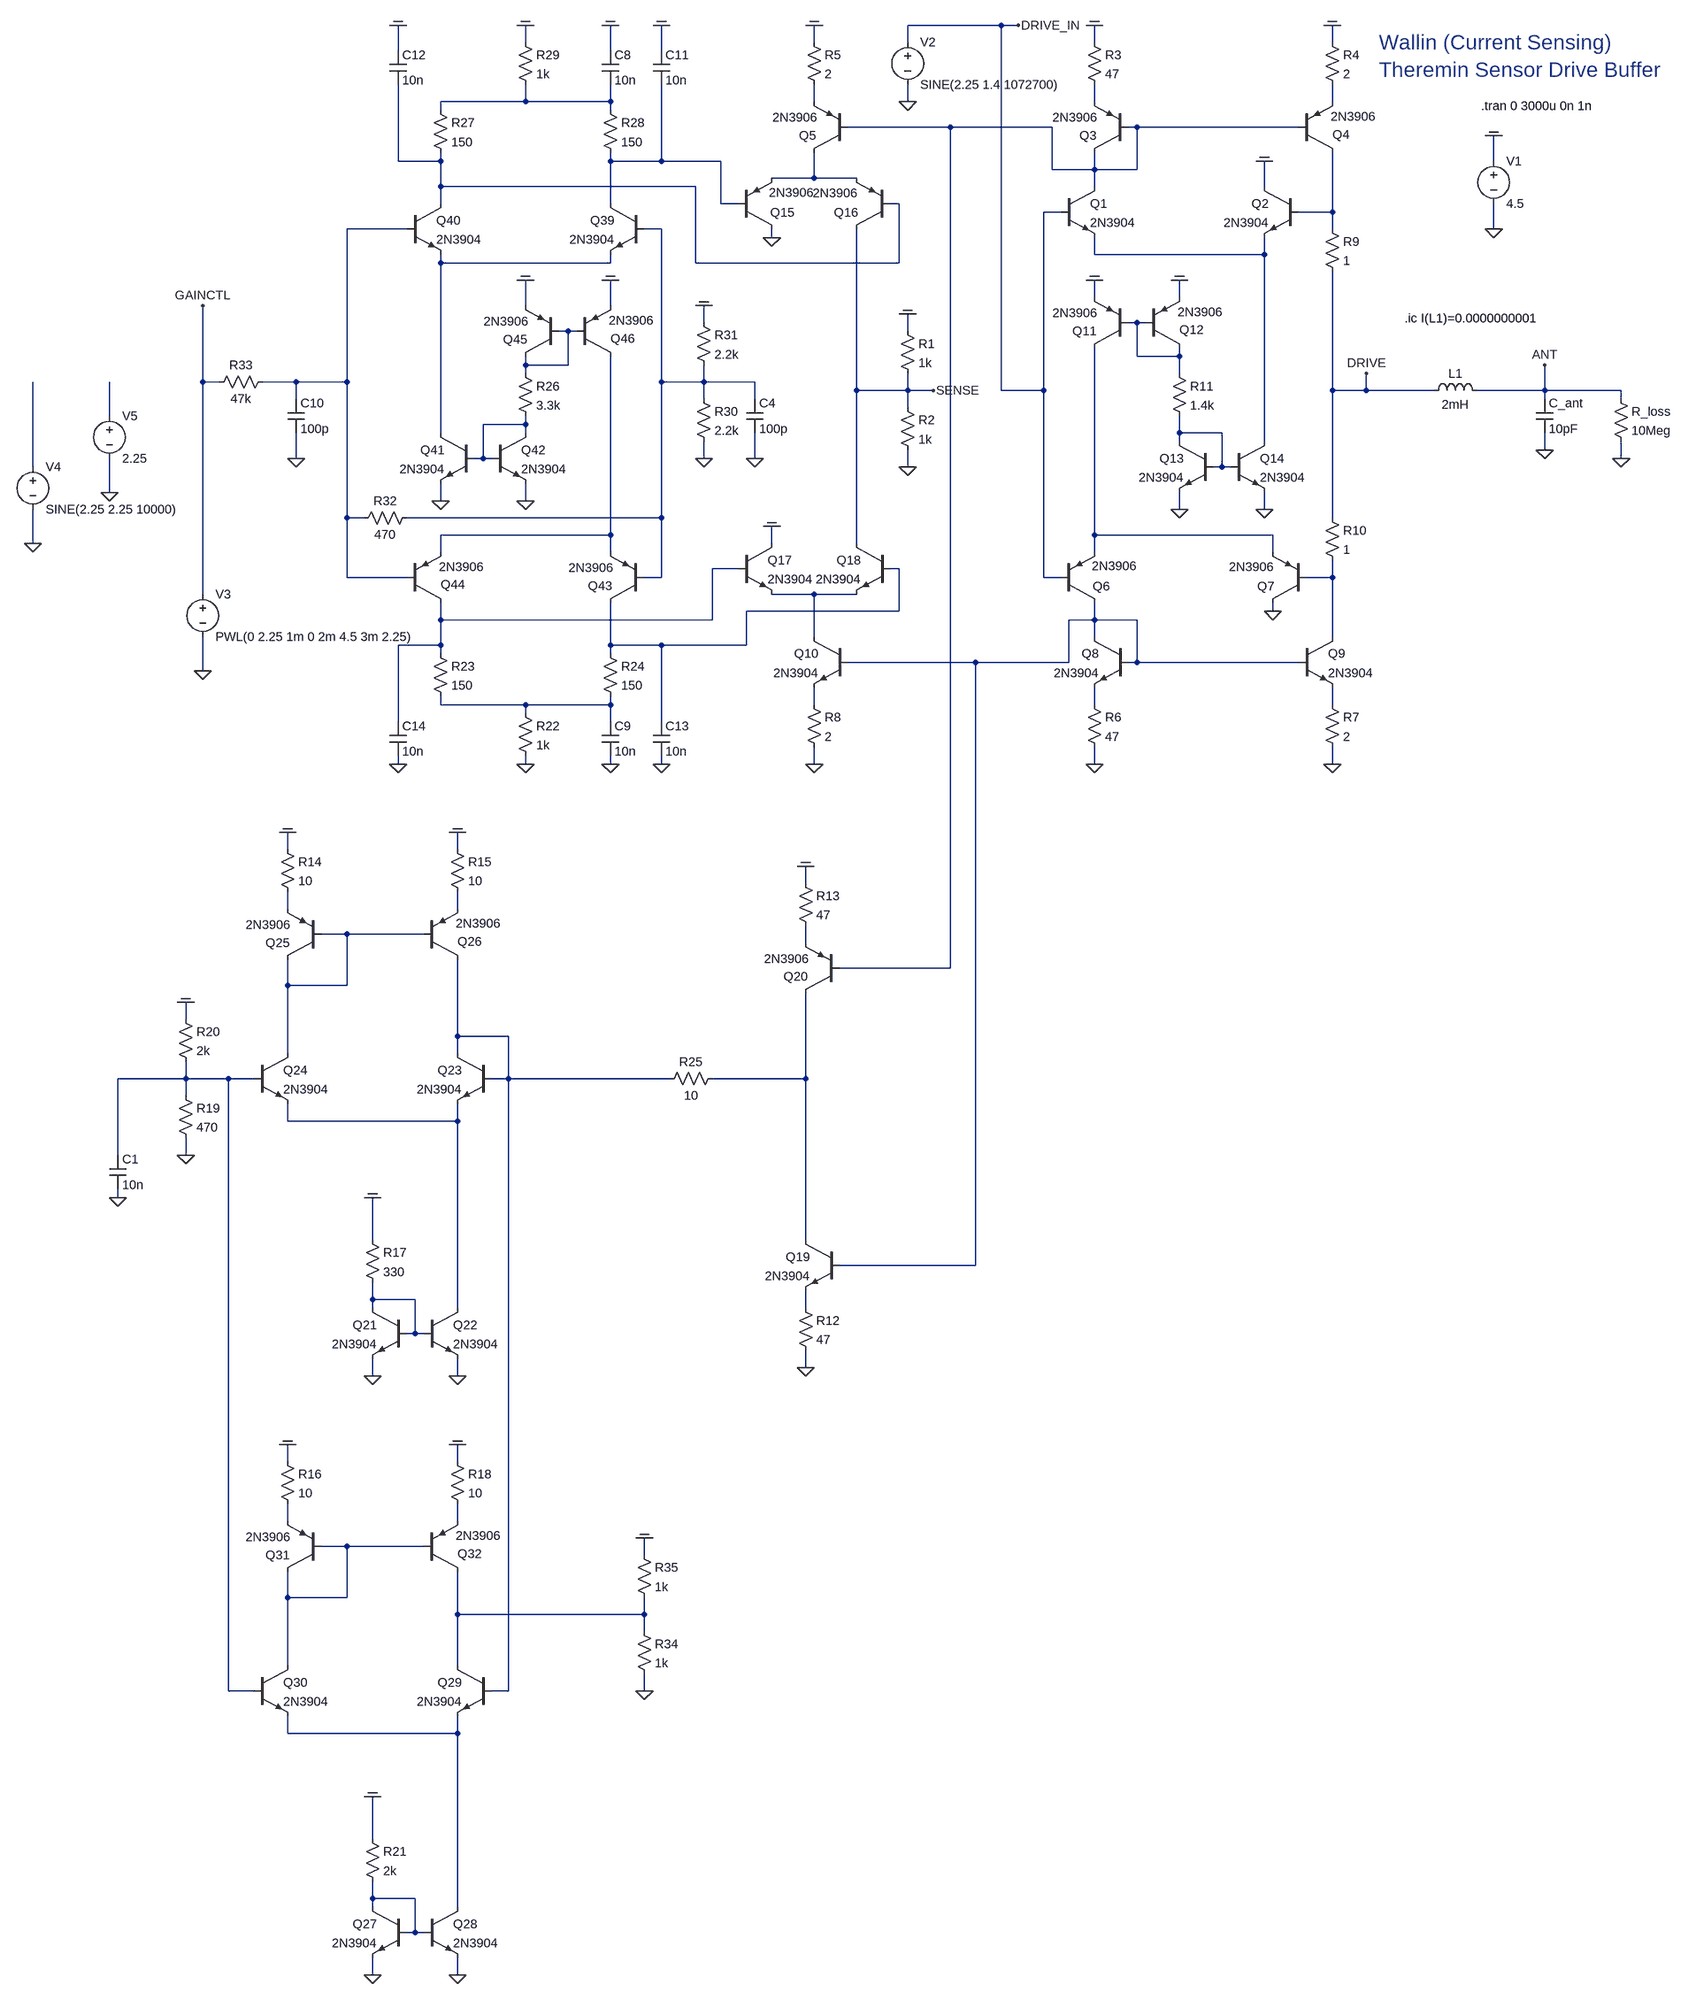
[diagram p0: schematic current_sensing_drive_buffer_v05.asc]
current_sensing_drive_buffer_v05.asc, the LTspice schematic file:
Version 4
SHEET 1 4504 7040
WIRE 1088 2256 912 2256
WIRE 1120 2256 1088 2256
WIRE 192 2288 192 2256
WIRE 736 2288 736 2256
WIRE 912 2288 912 2256
WIRE 1264 2288 1264 2256
WIRE 1712 2288 1712 2256
WIRE -48 2304 -48 2256
WIRE 352 2304 352 2256
WIRE 448 2304 448 2256
WIRE 192 2400 192 2368
WIRE 192 2400 32 2400
WIRE 352 2400 352 2368
WIRE 352 2400 192 2400
WIRE 736 2400 736 2368
WIRE 912 2400 912 2368
WIRE 1264 2400 1264 2368
WIRE 1712 2400 1712 2368
WIRE 32 2416 32 2400
WIRE 352 2416 352 2400
WIRE 992 2448 800 2448
WIRE 1184 2448 992 2448
WIRE 1344 2448 1328 2448
WIRE 1648 2448 1344 2448
WIRE -48 2512 -48 2368
WIRE 32 2512 32 2496
WIRE 32 2512 -48 2512
WIRE 352 2512 352 2496
WIRE 448 2512 448 2368
WIRE 448 2512 352 2512
WIRE 560 2512 448 2512
WIRE 2016 2512 2016 2464
WIRE 1184 2528 1184 2448
WIRE 1264 2528 1264 2496
WIRE 1264 2528 1184 2528
WIRE 1344 2528 1344 2448
WIRE 1344 2528 1264 2528
WIRE 736 2544 736 2496
WIRE 736 2544 656 2544
WIRE 816 2544 736 2544
WIRE 32 2560 32 2512
WIRE 512 2560 32 2560
WIRE 1264 2560 1264 2528
WIRE 1584 2560 1584 2512
WIRE 32 2592 32 2560
WIRE 352 2592 352 2512
WIRE 560 2592 560 2512
WIRE 592 2592 560 2592
WIRE 896 2592 880 2592
WIRE 1200 2608 1168 2608
WIRE 1712 2608 1712 2496
WIRE 1712 2608 1648 2608
WIRE -32 2640 -144 2640
WIRE 448 2640 416 2640
WIRE 1712 2640 1712 2608
WIRE 2016 2640 2016 2592
WIRE 656 2656 656 2640
WIRE 1264 2688 1264 2656
WIRE 1584 2688 1584 2656
WIRE 1584 2688 1264 2688
WIRE 32 2704 32 2688
WIRE 352 2704 352 2688
WIRE 352 2704 32 2704
WIRE 512 2704 512 2560
WIRE 896 2704 896 2592
WIRE 896 2704 512 2704
WIRE 1264 2768 1264 2736
WIRE 1424 2768 1424 2736
WIRE 192 2784 192 2736
WIRE 352 2784 352 2736
WIRE 528 2816 528 2784
WIRE 1344 2816 1328 2816
WIRE 1360 2816 1344 2816
WIRE 272 2832 256 2832
WIRE 288 2832 272 2832
WIRE 912 2832 912 2800
WIRE 1344 2880 1344 2816
WIRE 1424 2880 1424 2864
WIRE 1424 2880 1344 2880
WIRE 192 2896 192 2880
WIRE 272 2896 272 2832
WIRE 272 2896 192 2896
WIRE 192 2912 192 2896
WIRE 1424 2912 1424 2880
WIRE -416 2928 -416 2784
WIRE -384 2928 -416 2928
WIRE -240 2928 -304 2928
WIRE -144 2928 -144 2640
WIRE -144 2928 -240 2928
WIRE 448 2928 448 2640
WIRE 528 2928 528 2896
WIRE 528 2928 448 2928
WIRE 624 2928 528 2928
WIRE 816 2944 816 2640
WIRE 912 2944 912 2912
WIRE 912 2944 816 2944
WIRE 960 2944 912 2944
WIRE 1088 2944 1088 2256
WIRE 1168 2944 1168 2608
WIRE 1168 2944 1088 2944
WIRE 1712 2944 1712 2720
WIRE 1776 2944 1776 2912
WIRE 1776 2944 1712 2944
WIRE 1904 2944 1776 2944
WIRE 2112 2944 2112 2896
WIRE 2112 2944 1984 2944
WIRE 2256 2944 2112 2944
WIRE -240 2960 -240 2928
WIRE 528 2960 528 2928
WIRE 624 2960 624 2928
WIRE 2112 2960 2112 2944
WIRE 2256 2960 2256 2944
WIRE 912 2976 912 2944
WIRE -592 2992 -592 2928
WIRE 192 3008 192 2992
WIRE 192 3008 112 3008
WIRE 32 3024 32 2704
WIRE 192 3024 192 3008
WIRE 1424 3024 1424 2992
WIRE 1504 3024 1424 3024
WIRE 1424 3040 1424 3024
WIRE 1584 3040 1584 2688
WIRE 2112 3056 2112 3024
WIRE -240 3072 -240 3024
WIRE 112 3072 112 3008
WIRE 112 3072 96 3072
WIRE 128 3072 112 3072
WIRE 528 3072 528 3040
WIRE 624 3072 624 3024
WIRE 2256 3072 2256 3040
WIRE -736 3088 -736 2928
WIRE 912 3088 912 3056
WIRE 1504 3088 1504 3024
WIRE 1504 3088 1488 3088
WIRE 1520 3088 1504 3088
WIRE -592 3136 -592 3072
WIRE 32 3152 32 3120
WIRE 192 3152 192 3120
WIRE 1424 3168 1424 3136
WIRE 1584 3168 1584 3136
WIRE -144 3184 -144 2928
WIRE -112 3184 -144 3184
WIRE 448 3184 448 2928
WIRE 448 3184 -32 3184
WIRE 1712 3184 1712 2944
WIRE 352 3216 352 2880
WIRE 352 3216 32 3216
WIRE 1264 3216 1264 2864
WIRE 1600 3216 1264 3216
WIRE -736 3232 -736 3168
WIRE 656 3232 656 3200
WIRE 816 3232 816 2944
WIRE 32 3248 32 3216
WIRE 352 3248 352 3216
WIRE 1264 3248 1264 3216
WIRE 1600 3248 1600 3216
WIRE 592 3280 544 3280
WIRE 896 3280 880 3280
WIRE -144 3296 -144 3184
WIRE -32 3296 -144 3296
WIRE 448 3296 448 3184
WIRE 448 3296 416 3296
WIRE 1168 3296 1168 2944
WIRE 1200 3296 1168 3296
WIRE 1712 3296 1712 3264
WIRE 1712 3296 1664 3296
WIRE -416 3328 -416 2928
WIRE 736 3328 656 3328
WIRE 816 3328 736 3328
WIRE 896 3360 896 3280
WIRE 896 3360 608 3360
WIRE 1600 3360 1600 3344
WIRE 32 3376 32 3344
WIRE 544 3376 544 3280
WIRE 544 3376 32 3376
WIRE 1264 3376 1264 3344
WIRE 1264 3376 1216 3376
WIRE 1344 3376 1264 3376
WIRE 736 3408 736 3328
WIRE 1264 3408 1264 3376
WIRE 1712 3408 1712 3296
WIRE 32 3424 32 3376
WIRE 32 3424 -48 3424
WIRE 352 3424 352 3344
WIRE 448 3424 352 3424
WIRE 608 3424 608 3360
WIRE 608 3424 448 3424
WIRE 32 3440 32 3424
WIRE 352 3440 352 3424
WIRE 1040 3456 800 3456
WIRE 1216 3456 1216 3376
WIRE 1216 3456 1040 3456
WIRE 1344 3456 1344 3376
WIRE 1344 3456 1328 3456
WIRE 1648 3456 1344 3456
WIRE -416 3472 -416 3408
WIRE 32 3536 32 3520
WIRE 192 3536 32 3536
WIRE 352 3536 352 3520
WIRE 352 3536 192 3536
WIRE 736 3536 736 3504
WIRE 1264 3536 1264 3504
WIRE 1712 3536 1712 3504
WIRE 192 3552 192 3536
WIRE -48 3568 -48 3424
WIRE 352 3568 352 3536
WIRE 448 3568 448 3424
WIRE -48 3648 -48 3632
WIRE 192 3648 192 3632
WIRE 352 3648 352 3632
WIRE 448 3648 448 3632
WIRE 736 3648 736 3616
WIRE 1264 3648 1264 3616
WIRE 1712 3648 1712 3616
WIRE -256 3840 -256 3808
WIRE 64 3840 64 3808
WIRE 720 3904 720 3872
WIRE -256 3952 -256 3920
WIRE 64 3952 64 3920
WIRE -144 4000 -192 4000
WIRE 0 4000 -144 4000
WIRE 720 4016 720 3984
WIRE 992 4064 992 2448
WIRE 992 4064 784 4064
WIRE -256 4096 -256 4048
WIRE -144 4096 -144 4000
WIRE -144 4096 -256 4096
WIRE -448 4160 -448 4128
WIRE 64 4192 64 4048
WIRE 160 4192 64 4192
WIRE -256 4224 -256 4096
WIRE 64 4224 64 4192
WIRE -448 4272 -448 4240
WIRE -448 4272 -576 4272
WIRE -368 4272 -448 4272
WIRE -320 4272 -368 4272
WIRE 160 4272 160 4192
WIRE 160 4272 128 4272
WIRE 464 4272 160 4272
WIRE 720 4272 720 4112
WIRE 720 4272 544 4272
WIRE -448 4304 -448 4272
WIRE -256 4352 -256 4320
WIRE 64 4352 64 4320
WIRE 64 4352 -256 4352
WIRE -576 4416 -576 4272
WIRE -448 4416 -448 4384
WIRE -576 4496 -576 4480
WIRE -96 4576 -96 4496
WIRE 720 4576 720 4272
WIRE 1040 4624 1040 3456
WIRE 1040 4624 784 4624
WIRE -96 4688 -96 4656
WIRE -16 4688 -96 4688
WIRE -96 4704 -96 4688
WIRE 64 4704 64 4352
WIRE 720 4704 720 4672
WIRE -16 4752 -16 4688
WIRE -16 4752 -32 4752
WIRE 0 4752 -16 4752
WIRE 720 4816 720 4784
WIRE -96 4832 -96 4800
WIRE 64 4832 64 4800
WIRE -256 5040 -256 5008
WIRE 64 5040 64 5008
WIRE -256 5152 -256 5120
WIRE 64 5152 64 5120
WIRE -144 5200 -192 5200
WIRE 0 5200 -144 5200
WIRE 416 5216 416 5184
WIRE -256 5296 -256 5248
WIRE -144 5296 -144 5200
WIRE -144 5296 -256 5296
WIRE 64 5328 64 5248
WIRE 416 5328 416 5296
WIRE 416 5328 64 5328
WIRE 416 5360 416 5328
WIRE -256 5424 -256 5296
WIRE 64 5424 64 5328
WIRE -368 5472 -368 4272
WIRE -320 5472 -368 5472
WIRE 160 5472 160 4272
WIRE 160 5472 128 5472
WIRE 416 5472 416 5440
WIRE -256 5552 -256 5520
WIRE 64 5552 64 5520
WIRE 64 5552 -256 5552
WIRE -96 5776 -96 5696
WIRE -96 5888 -96 5856
WIRE -16 5888 -96 5888
WIRE -96 5904 -96 5888
WIRE 64 5904 64 5552
WIRE -16 5952 -16 5888
WIRE -16 5952 -32 5952
WIRE 0 5952 -16 5952
WIRE -96 6032 -96 6000
WIRE 64 6032 64 6000
FLAG 2016 2640 0
FLAG 2016 2464 COM
FLAG 1424 3168 0
FLAG 1584 3168 0
FLAG 1264 2256 COM
FLAG 1712 2256 COM
FLAG 1584 2512 COM
FLAG 912 2400 0
FLAG 1424 2736 COM
FLAG 1264 2736 COM
FLAG 1264 3648 0
FLAG 1712 3648 0
FLAG 1600 3360 0
FLAG 736 2256 COM
FLAG 736 3648 0
FLAG 2112 3056 0
FLAG 2112 2896 ANT
FLAG 1776 2912 DRIVE
FLAG 2256 3072 0
FLAG 912 3088 0
FLAG 912 2800 COM
FLAG 960 2944 SENSE
FLAG 1120 2256 DRIVE_IN
FLAG 656 2656 0
FLAG 656 3200 COM
FLAG -416 3472 0
FLAG -416 2784 GAINCTL
FLAG 192 3648 0
FLAG 32 3152 0
FLAG 192 3152 0
FLAG 192 2736 COM
FLAG 352 2736 COM
FLAG 192 2256 COM
FLAG 528 3072 0
FLAG 528 2784 COM
FLAG 624 3072 0
FLAG 352 3648 0
FLAG 352 2256 COM
FLAG -240 3072 0
FLAG 448 2256 COM
FLAG -48 2256 COM
FLAG 448 3648 0
FLAG -48 3648 0
FLAG -736 3232 0
FLAG -592 3136 0
FLAG 720 4816 0
FLAG 720 3872 COM
FLAG -96 4832 0
FLAG 64 4832 0
FLAG -256 3808 COM
FLAG 64 3808 COM
FLAG -96 4496 COM
FLAG -448 4416 0
FLAG -448 4128 COM
FLAG -576 4496 0
FLAG -96 6032 0
FLAG 64 6032 0
FLAG -256 5008 COM
FLAG 64 5008 COM
FLAG -96 5696 COM
FLAG 416 5472 0
FLAG 416 5184 COM
SYMBOL voltage 2016 2496 R0
SYMATTR InstName V1
SYMATTR Value 4.5
SYMBOL npn 1488 3040 M0
SYMATTR InstName Q13
SYMATTR Value 2N3904
SYMBOL npn 1520 3040 R0
SYMATTR InstName Q14
SYMATTR Value 2N3904
SYMBOL npn 1648 2560 M0
SYMATTR InstName Q2
SYMATTR Value 2N3904
SYMBOL npn 1200 2560 R0
SYMATTR InstName Q1
SYMATTR Value 2N3904
SYMBOL pnp 1328 2496 R180
WINDOW 0 60 32 Left 2
WINDOW 3 58 66 Left 2
SYMATTR InstName Q3
SYMATTR Value 2N3906
SYMBOL Res 1248 2272 R0
SYMATTR InstName R3
SYMATTR Value 47
SYMBOL pnp 1648 2496 M180
WINDOW 0 64 34 Left 2
WINDOW 3 61 68 Left 2
SYMATTR InstName Q4
SYMATTR Value 2N3906
SYMBOL Res 1696 2272 R0
SYMATTR InstName R4
SYMATTR Value 2
SYMBOL Voltage 912 2272 R0
SYMATTR InstName V2
SYMATTR Value SINE(2.25 1.4 1072700)
SYMBOL pnp 1328 2864 R180
WINDOW 0 60 32 Left 2
WINDOW 3 58 66 Left 2
SYMATTR InstName Q11
SYMATTR Value 2N3906
SYMBOL pnp 1360 2864 M180
WINDOW 0 64 34 Left 2
WINDOW 3 61 68 Left 2
SYMATTR InstName Q12
SYMATTR Value 2N3906
SYMBOL npn 1328 3408 M0
SYMATTR InstName Q8
SYMATTR Value 2N3904
SYMBOL npn 1648 3408 R0
SYMATTR InstName Q9
SYMATTR Value 2N3904
SYMBOL Res 1248 3520 R0
SYMATTR InstName R6
SYMATTR Value 47
SYMBOL Res 1696 3520 R0
SYMATTR InstName R7
SYMATTR Value 2
SYMBOL pnp 1664 3344 R180
WINDOW 0 61 31 Left 2
WINDOW 3 62 68 Left 2
SYMATTR InstName Q7
SYMATTR Value 2N3906
SYMBOL pnp 1200 3344 M180
WINDOW 0 61 31 Left 2
WINDOW 3 59 69 Left 2
SYMATTR InstName Q6
SYMATTR Value 2N3906
SYMBOL Res 1696 3168 R0
SYMATTR InstName R10
SYMATTR Value 1
SYMBOL Res 1696 2624 R0
SYMATTR InstName R9
SYMATTR Value 1
SYMBOL pnp 800 2496 R180
WINDOW 0 60 32 Left 2
WINDOW 3 58 66 Left 2
SYMATTR InstName Q5
SYMATTR Value 2N3906
SYMBOL Res 720 2272 R0
SYMATTR InstName R5
SYMATTR Value 2
SYMBOL npn 800 3408 M0
SYMATTR InstName Q10
SYMATTR Value 2N3904
SYMBOL Res 720 3520 R0
SYMATTR InstName R8
SYMATTR Value 2
SYMBOL ind 1888 2960 R270
WINDOW 0 32 56 VTop 2
WINDOW 3 5 56 VBottom 2
SYMATTR InstName L1
SYMATTR Value 2mH
SYMATTR SpiceLine Rser=120 Cpar=1pF
SYMBOL Cap 2096 2960 R0
SYMATTR InstName C_ant
SYMATTR Value 10pF
SYMBOL Res 2240 2944 R0
SYMATTR InstName R_loss
SYMATTR Value 10Meg
SYMBOL Res 896 2960 R0
SYMATTR InstName R2
SYMATTR Value 1k
SYMBOL Res 896 2816 R0
SYMATTR InstName R1
SYMATTR Value 1k
SYMBOL Res 1408 2896 R0
SYMATTR InstName R11
SYMATTR Value 1.4k
SYMBOL pnp 880 2640 R180
WINDOW 0 61 31 Left 2
WINDOW 3 62 68 Left 2
SYMATTR InstName Q16
SYMATTR Value 2N3906
SYMBOL pnp 592 2640 M180
WINDOW 0 61 31 Left 2
WINDOW 3 59 69 Left 2
SYMATTR InstName Q15
SYMATTR Value 2N3906
SYMBOL npn 880 3232 M0
SYMATTR InstName Q18
SYMATTR Value 2N3904
SYMBOL npn 592 3232 R0
SYMATTR InstName Q17
SYMATTR Value 2N3904
SYMBOL Voltage -416 3312 R0
SYMATTR InstName V3
SYMATTR Value PWL(0 2.25 1m 0 2m 4.5 3m 2.25)
SYMBOL Res 176 3536 R0
SYMATTR InstName R22
SYMATTR Value 1k
SYMBOL Res 16 3424 R0
SYMATTR InstName R23
SYMATTR Value 150
SYMBOL Res 336 3424 R0
SYMATTR InstName R24
SYMATTR Value 150
SYMBOL npn 416 2592 M0
SYMATTR InstName Q39
SYMATTR Value 2N3904
SYMBOL npn -32 2592 R0
SYMATTR InstName Q40
SYMATTR Value 2N3904
SYMBOL npn 96 3024 M0
SYMATTR InstName Q41
SYMATTR Value 2N3904
SYMBOL npn 128 3024 R0
SYMATTR InstName Q42
SYMATTR Value 2N3904
SYMBOL pnp 416 3344 R180
WINDOW 0 60 32 Left 2
WINDOW 3 58 66 Left 2
SYMATTR InstName Q43
SYMATTR Value 2N3906
SYMBOL pnp -32 3344 M180
WINDOW 0 64 34 Left 2
WINDOW 3 61 68 Left 2
SYMATTR InstName Q44
SYMATTR Value 2N3906
SYMBOL pnp 256 2880 R180
WINDOW 0 60 32 Left 2
WINDOW 3 58 66 Left 2
SYMATTR InstName Q45
SYMATTR Value 2N3906
SYMBOL pnp 288 2880 M180
WINDOW 0 64 34 Left 2
WINDOW 3 61 68 Left 2
SYMATTR InstName Q46
SYMATTR Value 2N3906
SYMBOL Res 176 2896 R0
SYMATTR InstName R26
SYMATTR Value 3.3k
SYMBOL Res 16 2400 R0
SYMATTR InstName R27
SYMATTR Value 150
SYMBOL Res 336 2400 R0
SYMATTR InstName R28
SYMATTR Value 150
SYMBOL Res 176 2272 R0
SYMATTR InstName R29
SYMATTR Value 1k
SYMBOL Res 512 2944 R0
SYMATTR InstName R30
SYMATTR Value 2.2k
SYMBOL Res 512 2800 R0
SYMATTR InstName R31
SYMATTR Value 2.2k
SYMBOL Cap 608 2960 R0
SYMATTR InstName C4
SYMATTR Value 100p
SYMBOL Res -16 3168 R90
WINDOW 0 0 56 VBottom 2
WINDOW 3 32 56 VTop 2
SYMATTR InstName R32
SYMATTR Value 470
SYMBOL Res -288 2912 R90
WINDOW 0 0 56 VBottom 2
WINDOW 3 32 56 VTop 2
SYMATTR InstName R33
SYMATTR Value 47k
SYMBOL Cap 336 2304 R0
SYMATTR InstName C8
SYMATTR Value 10n
SYMBOL Cap 336 3568 R0
SYMATTR InstName C9
SYMATTR Value 10n
SYMBOL Cap -256 2960 R0
SYMATTR InstName C10
SYMATTR Value 100p
SYMBOL Cap 432 2304 R0
SYMATTR InstName C11
SYMATTR Value 10n
SYMBOL Cap -64 2304 R0
SYMATTR InstName C12
SYMATTR Value 10n
SYMBOL Cap 432 3568 R0
SYMATTR InstName C13
SYMATTR Value 10n
SYMBOL Cap -64 3568 R0
SYMATTR InstName C14
SYMATTR Value 10n
SYMBOL Voltage -736 3072 R0
SYMATTR InstName V4
SYMATTR Value SINE(2.25 2.25 10000)
SYMBOL Voltage -592 2976 R0
SYMATTR InstName V5
SYMATTR Value 2.25
SYMBOL npn 784 4576 M0
SYMATTR InstName Q19
SYMATTR Value 2N3904
SYMBOL Res 704 4688 R0
SYMATTR InstName R12
SYMATTR Value 47
SYMBOL pnp 784 4112 R180
WINDOW 0 60 32 Left 2
WINDOW 3 58 66 Left 2
SYMATTR InstName Q20
SYMATTR Value 2N3906
SYMBOL Res 704 3888 R0
SYMATTR InstName R13
SYMATTR Value 47
SYMBOL npn -32 4704 M0
SYMATTR InstName Q21
SYMATTR Value 2N3904
SYMBOL npn 0 4704 R0
SYMATTR InstName Q22
SYMATTR Value 2N3904
SYMBOL npn 128 4224 M0
SYMATTR InstName Q23
SYMATTR Value 2N3904
SYMBOL npn -320 4224 R0
SYMATTR InstName Q24
SYMATTR Value 2N3904
SYMBOL pnp -192 4048 R180
WINDOW 0 60 32 Left 2
WINDOW 3 58 66 Left 2
SYMATTR InstName Q25
SYMATTR Value 2N3906
SYMBOL Res -272 3824 R0
SYMATTR InstName R14
SYMATTR Value 10
SYMBOL pnp 0 4048 M180
WINDOW 0 64 34 Left 2
WINDOW 3 61 68 Left 2
SYMATTR InstName Q26
SYMATTR Value 2N3906
SYMBOL Res 48 3824 R0
SYMATTR InstName R15
SYMATTR Value 10
SYMBOL Res -112 4560 R0
SYMATTR InstName R17
SYMATTR Value 330
SYMBOL Res -464 4288 R0
SYMATTR InstName R19
SYMATTR Value 470
SYMBOL Res -464 4144 R0
SYMATTR InstName R20
SYMATTR Value 2k
SYMBOL Res 560 4256 R90
WINDOW 0 0 56 VBottom 2
WINDOW 3 32 56 VTop 2
SYMATTR InstName R25
SYMATTR Value 10
SYMBOL Cap -592 4416 R0
SYMATTR InstName C1
SYMATTR Value 10n
SYMBOL npn -32 5904 M0
SYMATTR InstName Q27
SYMATTR Value 2N3904
SYMBOL npn 0 5904 R0
SYMATTR InstName Q28
SYMATTR Value 2N3904
SYMBOL npn 128 5424 M0
SYMATTR InstName Q29
SYMATTR Value 2N3904
SYMBOL npn -320 5424 R0
SYMATTR InstName Q30
SYMATTR Value 2N3904
SYMBOL pnp -192 5248 R180
WINDOW 0 60 32 Left 2
WINDOW 3 58 66 Left 2
SYMATTR InstName Q31
SYMATTR Value 2N3906
SYMBOL Res -272 5024 R0
SYMATTR InstName R16
SYMATTR Value 10
SYMBOL pnp 0 5248 M180
WINDOW 0 64 34 Left 2
WINDOW 3 61 68 Left 2
SYMATTR InstName Q32
SYMATTR Value 2N3906
SYMBOL Res 48 5024 R0
SYMATTR InstName R18
SYMATTR Value 10
SYMBOL Res -112 5760 R0
SYMATTR InstName R21
SYMATTR Value 2k
SYMBOL Res 400 5344 R0
SYMATTR InstName R34
SYMATTR Value 1k
SYMBOL Res 400 5200 R0
SYMATTR InstName R35
SYMATTR Value 1k
TEXT 1992 2408 Left 2 !.tran 0 3000u 0n 1n
TEXT 1848 2808 Left 2 !.ic I(L1)=0.0000000001
TEXT 1800 2288 Left 4 ;Wallin (Current Sensing) \nTheremin Sensor Drive Buffer

The netlist it stands for:
* current_sensing_drive_buffer_v05.asc
V1 COM 0 4.5
Q13 N018 N018 0 0 2N3904
Q14 N012 N018 0 0 2N3904
Q2 COM N009 N012 0 2N3904
Q1 N005 DRIVE_IN N012 0 2N3904
Q3 N005 N005 N003 0 2N3906
R3 COM N003 47
Q4 N009 N005 N004 0 2N3906
R4 COM N004 2
V2 DRIVE_IN 0 SINE(2.25 1.4 1072700)
Q11 N021 N014 COM 0 2N3906
Q12 N014 N014 COM 0 2N3906
Q8 N026 N026 N029 0 2N3904
Q9 N024 N026 N030 0 2N3904
R6 N029 0 47
R7 N030 0 2
Q7 0 N024 N021 0 2N3906
Q6 N026 DRIVE_IN N021 0 2N3906
R10 DRIVE N024 1
R9 N009 DRIVE 1
Q5 N008 N005 N002 0 2N3906
R5 COM N002 2
Q10 N025 N026 N028 0 2N3904
R8 N028 0 2
L1 DRIVE ANT 2mH Rser=120 Cpar=1pF
C_ant ANT 0 10pF
R_loss ANT 0 10Meg
R2 SENSE 0 1k
R1 COM SENSE 1k
R11 N014 N018 1.4k
Q16 SENSE N006 N008 0 2N3906
Q15 0 N007 N008 0 2N3906
Q18 SENSE N023 N025 0 2N3904
Q17 COM N022 N025 0 2N3904
V3 GAINCTL 0 PWL(0 2.25 1m 0 2m 4.5 3m 2.25)
R22 N027 0 1k
R23 N022 N027 150
R24 N023 N027 150
Q39 N007 N011 N013 0 2N3904
Q40 N006 N010 N013 0 2N3904
Q41 N013 N017 0 0 2N3904
Q42 N017 N017 0 0 2N3904
Q43 N023 N011 N020 0 2N3906
Q44 N022 N010 N020 0 2N3906
Q45 N015 N015 COM 0 2N3906
Q46 N020 N015 COM 0 2N3906
R26 N015 N017 3.3k
R27 N001 N006 150
R28 N001 N007 150
R29 COM N001 1k
R30 N011 0 2.2k
R31 COM N011 2.2k
C4 N011 0 100p
R32 N011 N010 470
R33 N010 GAINCTL 47k
C8 COM N001 10n
C9 N027 0 10n
C10 N010 0 100p
C11 COM N007 10n
C12 COM N006 10n
C13 N023 0 10n
C14 N022 0 10n
V4 N019 0 SINE(2.25 2.25 10000)
V5 N016 0 2.25
Q19 N037 N026 N040 0 2N3904
R12 N040 0 47
Q20 N037 N005 N034 0 2N3906
R13 COM N034 47
Q21 N039 N039 0 0 2N3904
Q22 N038 N039 0 0 2N3904
Q23 N035 N035 N038 0 2N3904
Q24 N033 N036 N038 0 2N3904
Q25 N033 N033 N031 0 2N3906
R14 COM N031 10
Q26 N035 N033 N032 0 2N3906
R15 COM N032 10
R17 COM N039 330
R19 N036 0 470
R20 COM N036 2k
R25 N037 N035 10
C1 N036 0 10n
Q27 N046 N046 0 0 2N3904
Q28 N045 N046 0 0 2N3904
Q29 N044 N035 N045 0 2N3904
Q30 N043 N036 N045 0 2N3904
Q31 N043 N043 N041 0 2N3906
R16 COM N041 10
Q32 N044 N043 N042 0 2N3906
R18 COM N042 10
R21 COM N046 2k
R34 N044 0 1k
R35 COM N044 1k
.model NPN NPN
.model PNP PNP
.lib standard.bjt
.tran 0 3000u 0n 1n
.ic I(L1)=0.0000000001
* Wallin (Current Sensing)
* Theremin Sensor Drive Buffer
.backanno
.end